# Altium project Atmega8a dev board.PrjPcb
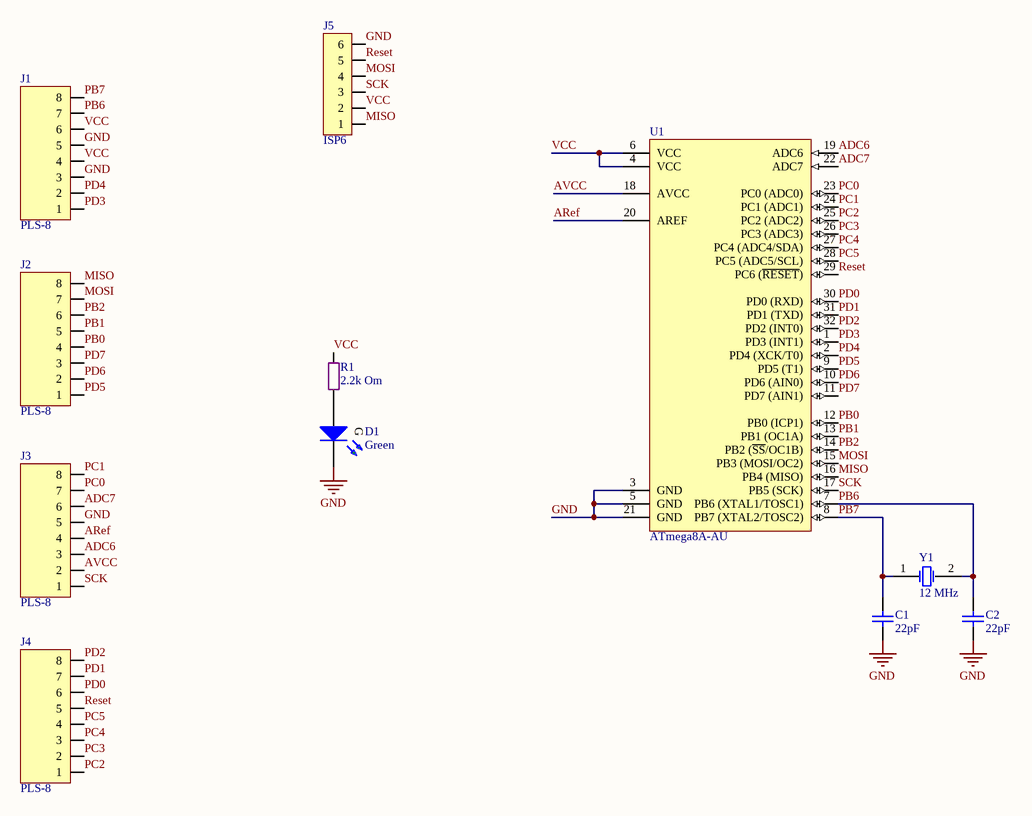
[diagram p0: Atmega8a dev board.SchDoc]
1 sheet, 11 parts. Net scope: global (net labels, ports and power ports of the same name join across sheets).
Board file: Atmega8a dev board.PcbDoc

## Sheet Atmega8a dev board.SchDoc
size A4

### Parts
C1  22pF  [SMD 0805 (2012)]
C2  22pF  [SMD 0805 (2012)]
D1  Green  [LED SMD 0805 Green]
J1  PLS-8  [Line 2.54 x 8]
J2  PLS-8  [Line 2.54 x 8]
J3  PLS-8  [Line 2.54 x 8]
J4  PLS-8  [Line 2.54 x 8]
J5  ISP6  [LINE 2.54 x 6D (2 x 3)]
R1  2.2k Om  [SMD 0805 (2012)]
U1  ATmega8A-AU  [32A_M]
Y1  12 MHz  [XTAL - 2]

### Nets
GND: C1.1 C2.1 D1.K J1.3 J1.5 J3.5 J5.6 U1.3(GND) U1.5(GND) U1.21(GND)
ADC6: J3.3 U1.19(ADC6)
ADC7: J3.6 U1.22(ADC7)
ARef: J3.4 U1.20(AREF)
AVCC: J3.2 U1.18(AVCC)
MISO: J2.8 J5.1 U1.16(PB4_(MISO))
MOSI: J2.7 J5.4 U1.15(PB3_(MOSI/OC2))
PB0: J2.4 U1.12(PB0_(ICP1))
PB1: J2.5 U1.13(PB1_(OC1A))
PB2: J2.6 U1.14(PB2_(~{SS}/OC1B))
PB6: C2.2 J1.7 U1.7(PB6_(XTAL1/TOSC1)) Y1.2(OSC2)
PB7: C1.2 J1.8 U1.8(PB7_(XTAL2/TOSC2)) Y1.1(OSC1)
PC0: J3.7 U1.23(PC0_(ADC0))
PC1: J3.8 U1.24(PC1_(ADC1))
PC2: J4.1 U1.25(PC2_(ADC2))
PC3: J4.2 U1.26(PC3_(ADC3))
PC4: J4.3 U1.27(PC4_(ADC4/SDA))
PC5: J4.4 U1.28(PC5_(ADC5/SCL))
PD0: J4.6 U1.30(PD0_(RXD))
PD1: J4.7 U1.31(PD1_(TXD))
PD2: J4.8 U1.32(PD2_(INT0))
PD3: J1.1 U1.1(PD3_(INT1))
PD4: J1.2 U1.2(PD4_(XCK/T0))
PD5: J2.1 U1.9(PD5_(T1))
PD6: J2.2 U1.10(PD6_(AIN0))
PD7: J2.3 U1.11(PD7_(AIN1))
Reset: J4.5 J5.5 U1.29(PC6_(~{RESET}))
SCK: J3.1 J5.3 U1.17(PB5_(SCK))
VCC: J1.4 J1.6 J5.2 R1.1 U1.4(VCC) U1.6(VCC)
NetD1_A: D1.A R1.2

### Notes on the sheet
- (in symbol Led SMD 0805 Green) G

### Library data of the parts
C1 C2 = Cap SMD 0402-1812: Capacitor
D1 = Led SMD 0805 Green: ?2v ?20mA; Forward Voltage TYP: ?2; Resistor for 5v VCC: 330 Om; Forward Voltage Min: ?; Wave len min/typ: ?; Liminous Min (mcd): ?; Liminous Typ (mcd): ?; Forward Amp (mA): ?; Color: Green
J1-J4 = PLS-8: Vert, Sgl line, Male
J5 = PLD-6 (2 x 3): Vert, Dbl line, Male
R1 = Res All Types
U1 = ATmega8A-AU: 8-bit AVR Microcontroller, 8KB Flash, 512 Bytes EEPROM, 1KB SRAM, 32-pin TQFP, Industrial Grade (-40°C to 85°C); Published: 1-Apr-2010; DatasheetVersion: revC, Jul-2009; PackageVersion: revB, Oct-2001; PackageReference: 32A; Publisher: Altium Limited; PackageDescription: 32-Lead, 7x7x1.0 mm Body, 0.8mm Lead Pitch, Thin Profile Plastic Quad Flat Package (TQFP); Supplier 1: Digi-Key; Supplier Part Number 1: ATMEGA8A-AU-ND; Supplier 2: Farnell; Supplier Part Number 2: 1748532; Supplier 3: Mouser; Supplier Part Number 3: 556-ATMEGA8A-AU; Code_JEDEC: MS-026-ABA; ComponentLink1Description: Manufacturer Link; ComponentLink1URL: http://www.atmel.com/products/avr/default.asp?; ComponentLink2Description: ATmega8A Datasheet; ComponentLink2URL: http://www.atmel.com/dyn/resources/prod_documents/doc8159.pdf; ComponentLink3Description: ATmega8A Summary; ComponentLink3URL: http://www.atmel.com/dyn/resources/prod_documents/8159S.pdf; ComponentLink4Description: Atmel.com Home; ComponentLink4URL: http://www.atmel.com
Y1 = XTAL: Crystal Oscillator; Published: 8-Jun-2000; LatestRevisionDate: 17-Jul-2002; LatestRevisionNote: Re-released for DXP Platform.; PackageReference: R38; Publisher: Altium Limited; PackageDescription: Crystal, Thru-Hole; 2 Leads; Body 3.1 x 8.2 mm (Dia.xH)